# EAGLE design anambe_azul (EAGLE 7.7.0)
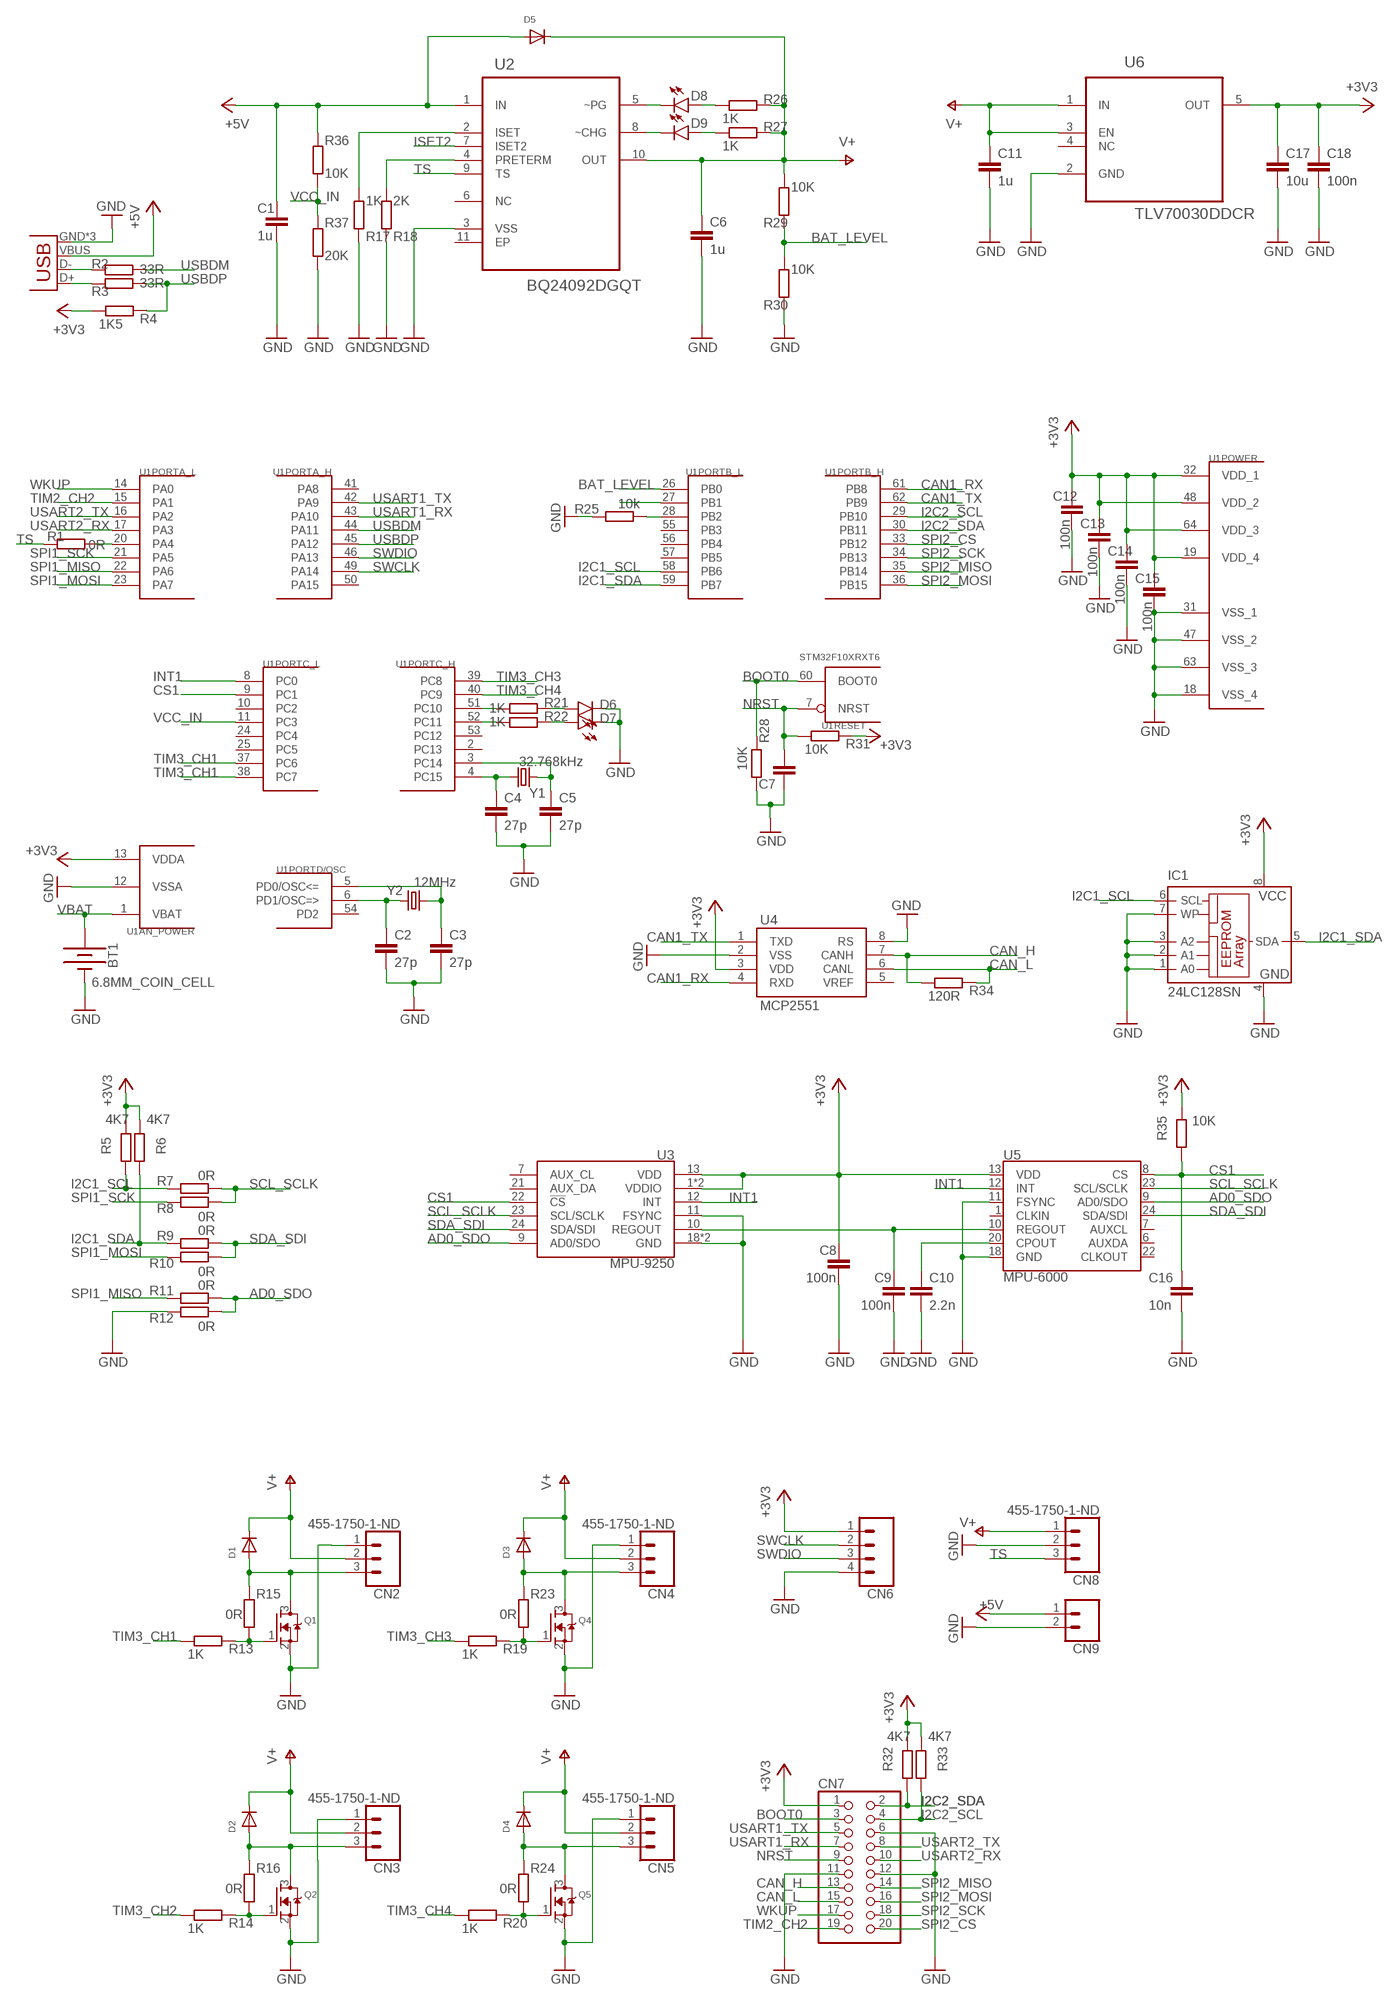
[diagram p0: schematic, sheet 1]

## Parts
BT1  6.8MM_COIN_CELL  BATTERY-6.8MM_SMD  [BATTCON-6.8MM]
C1  1u  C-EUC0603  [C0603]
C2  27p  C-EUC0603  [C0603]
C3  27p  C-EUC0603  [C0603]
C4  27p  C-EUC0603  [C0603]
C5  27p  C-EUC0603  [C0603]
C6  1u  C-EUC0603  [C0603]
C7  C-EUC0603  [C0603]
C8  100n  C-EUC0603  [C0603]
C9  100n  C-EUC0603  [C0603]
C10  2.2n  C-EUC0603  [C0603]
C11  1u  C-EUC0603  [C0603]
C12  100n  C-EUC0603  [C0603]
C13  100n  C-EUC0603  [C0603]
C14  100n  C-EUC0603  [C0603]
C15  100n  C-EUC0603  [C0603]
C16  10n  C-EUC0603  [C0603]
C17  10u  C-EUC0603  [C0603]
C18  100n  C-EUC0603  [C0603]
CN1  SPARKFUN-CONNECTORS_USB-MICROB  [SPARKFUN-CONNECTORS_USB-MICROB]
CN2  455-1750-1-ND  CONN_03  [1X03]
CN3  455-1750-1-ND  CONN_03  [1X03]
CN4  455-1750-1-ND  CONN_03  [1X03]
CN5  455-1750-1-ND  CONN_03  [1X03]
CN6  CONN_04  [1X04]
CN7  PINHD-2X10  [2X10]
CN8  455-1750-1-ND  CONN_03  [1X03]
CN9  CONN_02  [1X02]
D1  DIODESOD-123  [SOD-123]
D2  DIODESOD-123  [SOD-123]
D3  DIODESOD-123  [SOD-123]
D4  DIODESOD-123  [SOD-123]
D5  DIODESOD-123  [SOD-123]
D6  LED0603  [LED-0603]
D7  LED0603  [LED-0603]
D8  LED0603  [LED-0603]
D9  LED0603  [LED-0603]
IC1  24LC128SN  [SO-08]
Q1  MOSFET-NREFLOW  [SOT23]
Q2  MOSFET-NREFLOW  [SOT23]
Q4  MOSFET-NREFLOW  [SOT23]
Q5  MOSFET-NREFLOW  [SOT23]
R1  0R  R-EU_R0603  [R0603]
R2  33R  R-EU_R0603  [R0603]
R3  33R  R-EU_R0603  [R0603]
R4  1K5  R-EU_R0603  [R0603]
R5  4K7  R-EU_R0603  [R0603]
R6  4K7  R-EU_R0603  [R0603]
R7  0R  R-EU_R0603  [R0603]
R8  0R  R-EU_R0603  [R0603]
R9  0R  R-EU_R0603  [R0603]
R10  0R  R-EU_R0603  [R0603]
R11  0R  R-EU_R0603  [R0603]
R12  0R  R-EU_R0603  [R0603]
R13  1K  R-EU_R0603  [R0603]
R14  1K  R-EU_R0603  [R0603]
R15  0R  R-EU_R0603  [R0603]
R16  0R  R-EU_R0603  [R0603]
R17  1K  R-EU_R0603  [R0603]
R18  2K  R-EU_R0603  [R0603]
R19  1K  R-EU_R0603  [R0603]
R20  1K  R-EU_R0603  [R0603]
R21  1K  R-EU_R0603  [R0603]
R22  1K  R-EU_R0603  [R0603]
R23  0R  R-EU_R0603  [R0603]
R24  0R  R-EU_R0603  [R0603]
R25  10k  R-EU_R0603  [R0603]
R26  1K  R-EU_R0603  [R0603]
R27  1K  R-EU_R0603  [R0603]
R28  10K  R-EU_R0603  [R0603]
R29  10K  R-EU_R0603  [R0603]
R30  10K  R-EU_R0603  [R0603]
R31  10K  R-EU_R0603  [R0603]
R32  4K7  R-EU_R0603  [R0603]
R33  4K7  R-EU_R0603  [R0603]
R34  120R  R-EU_R0603  [R0603]
R35  10K  R-EU_R0603  [R0603]
R36  10K  R-EU_R0603  [R0603]
R37  20K  R-EU_R0603  [R0603]
U1  STM32F10XRXT6  [TQFP64]
U2  BQ24092DGQT  [SOP50P490X110-11N]
U3  MPU-9250  [QFN24-3X3]
U4  MCP2551  [SO08]
U5  MPU-6000  [QFN-24-EP]
U6  TLV70030DDCR  [SOT95P280X110-5N]
Y1  32.768kHz  CRYSTAL-32.768KHZPTH-2X6  [CRYSTAL-PTH-2X6-CYL]
Y2  12MHz  CRYSTALHC49UP  [HC49UP]

## Nets
+3V3: C8.1 C12.1 C13.1 C14.1 C15.1 C17.1 C18.1 CN6.1 CN7.1 IC1.8(VCC) R4.1 R5.1 R6.1 R31.2 R32.1 R33.1 R35.2 U1.13(AN_POWER:VDDA) U1.19(POWER:VDD_4) U1.32(POWER:VDD_1) U1.48(POWER:VDD_2) U1.64(POWER:VDD_3) U3.1(VDDIO) U3.8(VDDIO) U3.13(VDD) U4.3(VDD) U5.13(VDD) U6.5(OUT)
+5V: C1.1 CN1.VBUS CN9.1 D5.A R36.2 U2.1(IN)
AD0_SDO: R11.1 R12.1 U3.9(AD0/SDO) U5.9(AD0/SDO)
BAT_LEVEL: R29.2 R30.1 U1.26(PORTB_L:PB0)
BOOT0: CN7.3 R28.2 U1.60(RESET:BOOT0)
CAN1_RX: U1.61(PORTB_H:PB8) U4.4(RXD)
CAN1_TX: U1.62(PORTB_H:PB9) U4.1(TXD)
CAN_H: CN7.13 R34.1 U4.7(CANH)
CAN_L: CN7.15 R34.2 U4.6(CANL)
CS1: C16.1 R35.1 U1.9(PORTC_L:PC1) U3.22(!CS) U5.8(CS)
GND: BT1.- C1.2 C2.2 C3.2 C4.2 C5.2 C6.2 C7.1 C8.2 C9.2 C10.2 C11.2 C12.2 C13.2 C14.2 C15.2 C16.2 C17.2 C18.2 CN1.GND CN1.MT1(GND) CN1.MT2(GND) CN2.1 CN3.1 CN4.1 CN5.1 CN6.4 CN7.6 CN7.11 CN7.12 CN8.2 CN9.2 D6.C D7.C IC1.1(A0) IC1.2(A1) IC1.3(A2) IC1.4(GND) IC1.7(WP) Q1.2(S) Q2.2(S) Q4.2(S) Q5.2(S) R12.2 R17.2 R18.2 R25.2 R28.1 R30.2 R37.2 U1.12(AN_POWER:VSSA) U1.18(POWER:VSS_4) U1.31(POWER:VSS_1) U1.47(POWER:VSS_2) U1.63(POWER:VSS_3) U2.3(VSS) U3.11(FSYNC) U3.18(GND) U3.20(GND) U4.2(VSS) U4.8(RS) U5.11(FSYNC) U5.18(GND) U6.2(GND)
I2C1_SCL: IC1.6(SCL) R5.2 R7.2 U1.58(PORTB_L:PB6)
I2C1_SDA: IC1.5(SDA) R6.2 R9.2 U1.59(PORTB_L:PB7)
I2C2_SCL: CN7.4 R33.2 U1.29(PORTB_H:PB10)
I2C2_SDA: CN7.2 R32.2 U1.30(PORTB_H:PB11)
INT1: U1.8(PORTC_L:PC0) U3.12(INT) U5.12(INT)
ISET2: U1.27(PORTB_L:PB1) U2.7(ISET2)
N$1: C2.1 U1.6(PORTD/OSC:PD1/OSC=>) Y2.1
N$2: CN1.D+ R3.1
N$3: C3.1 U1.5(PORTD/OSC:PD0/OSC<=) Y2.2
N$4: Q1.1(G) R13.2 R15.1
N$5: CN1.D- R2.1
N$6: C4.1 U1.4(PORTC_H:PC15) Y1.2
N$7: C5.1 U1.3(PORTC_H:PC14) Y1.1
N$8: CN2.3 D1.A Q1.3(D) R15.2
N$9: Q4.1(G) R19.2 R23.1
N$10: CN4.3 D3.A Q4.3(D) R23.2
N$11: Q2.1(G) R14.2 R16.1
N$12: C10.1 U5.20(CPOUT)
N$13: C9.1 U3.10(REGOUT) U5.10(REGOUT)
N$14: D9.C U2.8(~CHG)
N$15: CN3.3 D2.A Q2.3(D) R16.2
N$16: Q5.1(G) R20.2 R24.1
N$17: CN5.3 D4.A Q5.3(D) R24.2
N$18: R25.1 U1.28(PORTB_L:PB2)
N$19: D9.A R27.1
N$21: D8.A R26.1
N$22: D8.C U2.5(~PG)
N$23: R17.1 U2.2(ISET)
N$24: R18.1 U2.4(PRETERM)
N$25: R21.1 U1.51(PORTC_H:PC10)
N$26: R22.1 U1.52(PORTC_H:PC11)
N$27: D6.A R21.2
N$28: D7.A R22.2
N$29: R1.1 U1.20(PORTA_L:PA4)
NRST: C7.2 CN7.9 R31.1 U1.7(RESET:NRST)
SCL_SCLK: R7.1 R8.1 U3.23(SCL/SCLK) U5.23(SCL/SCLK)
SDA_SDI: R9.1 R10.1 U3.24(SDA/SDI) U5.24(SDA/SDI)
SPI1_MISO: R11.2 U1.22(PORTA_L:PA6)
SPI1_MOSI: R10.2 U1.23(PORTA_L:PA7)
SPI1_SCK: R8.2 U1.21(PORTA_L:PA5)
SPI2_CS: CN7.20 U1.33(PORTB_H:PB12)
SPI2_MISO: CN7.14 U1.35(PORTB_H:PB14)
SPI2_MOSI: CN7.16 U1.36(PORTB_H:PB15)
SPI2_SCK: CN7.18 U1.34(PORTB_H:PB13)
SWCLK: CN6.2 U1.49(PORTA_H:PA14)
SWDIO: CN6.3 U1.46(PORTA_H:PA13)
TIM2_CH2: CN7.19 U1.15(PORTA_L:PA1)
TIM3_CH1: R13.1 U1.37(PORTC_L:PC6)
TIM3_CH2: R14.1 U1.38(PORTC_L:PC7)
TIM3_CH3: R19.1 U1.39(PORTC_H:PC8)
TIM3_CH4: R20.1 U1.40(PORTC_H:PC9)
TS: CN8.3 R1.2 U2.9(TS)
USART1_RX: CN7.7 U1.43(PORTA_H:PA10)
USART1_TX: CN7.5 U1.42(PORTA_H:PA9)
USART2_RX: CN7.10 U1.17(PORTA_L:PA3)
USART2_TX: CN7.8 U1.16(PORTA_L:PA2)
USBDM: R2.2 U1.44(PORTA_H:PA11)
USBDP: R3.2 R4.2 U1.45(PORTA_H:PA12)
V+: C6.1 C11.1 CN2.2 CN3.2 CN4.2 CN5.2 CN8.1 D1.C D2.C D3.C D4.C D5.C R26.2 R27.2 R29.1 U2.10(OUT) U6.1(IN) U6.3(EN)
VBAT: BT1.+ U1.1(AN_POWER:VBAT)
VCC_IN: R36.1 R37.1 U1.11(PORTC_L:PC3)
WKUP: CN7.17 U1.14(PORTA_L:PA0)
Unconnected: U1.2(PORTC_H:PC13) U1.10(PORTC_L:PC2) U1.24(PORTC_L:PC4) U1.25(PORTC_L:PC5) U1.41(PORTA_H:PA8) U1.50(PORTA_H:PA15) U1.53(PORTC_H:PC12) U1.54(PORTD/OSC:PD2) U1.55(PORTB_L:PB3) U1.56(PORTB_L:PB4) U1.57(PORTB_L:PB5) U2.6(NC) U2.11(EP) U3.7(AUX_CL) U3.21(AUX_DA) U4.5(VREF) U5.1(CLKIN) U5.6(AUXDA) U5.7(AUXCL) U5.22(CLKOUT) U6.4(NC)

## Library data of the parts
BT1 = SparkFun-Batteries:BATTERY: Battery - Single Cell A variety of battery chemistries, sizes, and footprints. Device List: 20MM_PTH - Coin Cell Battery Holder - 20mm (PTH) <https://www.sparkfun.com/products/783> 6.8MM_PTH - Coin Cell Battery Holder - 6.8MM(SMD) <https://www.digikey.com/product-detail/en/seiko-instruments/MS621FE-FL11E/728-1057-ND/1889208?WT.srch=1&gclid=CNOQ5a6LzdQCFZS2wAodXCkE0g> 12MM_SMD - Coin Cell Battery Holder - 12mm (SMD) <https://www.sparkfun.com/products/10592> 12MM_PTH - Coin Cell Battery Holder - 12mm (PTH) <https://www.sparkfun.com/products/7948> 20MM_SMD - 20mm Coin Cell Battery Holder (SMD) (2 legs) Used on the Big Time Watch Kit <https://www.sparkfun.com/products/11734> 20MM_SMD_4LEGS - Coin Cell Battery Holder - 20mm (SMD) <https://www.sparkfun.com/products/11892> 20MM_SMD_4LEGS_OVERPASTE - Coin Cell Battery Holder - 20mm (SMD) <https://www.sparkfun.com/products/11892> (Over-paste on the legs) 24.5MM_PTH - Coin Cell Battery Holder - 24.5mm (PTH) <https://www.sparkfun.com/products/8863> 9V - 9V Battery Holder - PC Mount Used on the SparkFun SparkPunk Sound Kit <https://www.sparkfun.com/products/11177> and SparkFun SparkPunk Sequencer Kit <https://www.sparkfun.com/products/12707> 18650 - Battery Holder - 18650 (PTH) <https://www.sparkfun.com/products/13113> AA - Battery Holder - 1xAA (PTH) <https://www.sparkfun.com/products/7949> AAA - Battery Holder - 1xAAA (PTH) <https://www.sparkfun.com/products/12718> AA_KIT - Battery Holder - 1xAA (PTH) <https://www.sparkfun.com/products/7949> Special kit package - pads only have exposed copper on one side of the board. AAA_KIT - Battery Holder - 1xAAA (PTH) <https://www.sparkfun.com/products/12718> Special kit package - pads only have exposed copper on one side of the board.; PROD_ID: BATT-13734
C1-C18 = rcl:C-EU: CAPACITOR, European symbol
CN1 = vr-f4:SPARKFUN-CONNECTORS_USB: USB Connectors USB-B-PTH is fully proven SKU : PRT-00139/CONN-08278 USB-miniB is fully proven SKU : PRT-00587 USB-A-PCB is untested. USB-A-H is throughly reviewed, but untested. Spark Fun Electronics SKU : PRT-00437 USB-B-SMT is throughly reviewed, but untested. Needs silkscreen touching up. USB-A-S has not been used/tested USB-MB-H has not been used/tested USB-MICROB has been used. CONN-09505; PROD_ID: CONN-09505
CN2-CN5 CN8 = SparkFun-Connectors:CONN_03: Multi connection point. Often used as Generic Header-pin footprint for 0.1 inch spaced/style header connections On any of the 0.1 inch spaced packages, you can populate with these: Break Away Headers - Straight <https://www.sparkfun.com/products/116> (PRT-00116) Break Away Male Headers - Right Angle <https://www.sparkfun.com/products/553> (PRT-00553) Female Headers <https://www.sparkfun.com/products/115> (PRT-00115) Break Away Headers - Machine Pin <https://www.sparkfun.com/products/117> (PRT-00117) Break Away Female Headers - Swiss Machine Pin <https://www.sparkfun.com/products/743> (PRT-00743) Stackable Header - 3 Pin (Female, 0.1") <https://www.sparkfun.com/products/13875> (PRT-13875) For SCREWTERMINALS and SPRING TERMINALS visit here: Screw Terimnals on SparkFun.com <https://www.sparkfun.com/search/results?term=Screw+Terminals> (5mm/3.5mm/2.54mm spacing) This device is also useful as a general connection point to wire up your design to another part of your project. Our various solder wires solder well into these plated through hole pads. Hook-Up Wire - Assortment (Stranded, 22 AWG) <https://www.sparkfun.com/products/11375> (PRT-11375) Hook-Up Wire - Assortment (Solid Core, 22 AWG) <https://www.sparkfun.com/products/11367> (PRT-11367) View the entire wire category on our website here <https://www.sparkfun.com/categories/141> Special notes: Molex polarized connector foot print use with SKU : PRT-08232 with associated crimp pins and housings.; PROD_ID: XXX-00000
CN6 = SparkFun-Connectors:CONN_04: Multi connection point. Often used as Generic Header-pin footprint for 0.1 inch spaced/style header connections On any of the 0.1 inch spaced packages, you can populate with these: Break Away Headers - Straight <https://www.sparkfun.com/products/116> (PRT-00116) Break Away Male Headers - Right Angle <https://www.sparkfun.com/products/553> (PRT-00553) Female Headers <https://www.sparkfun.com/products/115> (PRT-00115) Break Away Headers - Machine Pin <https://www.sparkfun.com/products/117> (PRT-00117) Break Away Female Headers - Swiss Machine Pin <https://www.sparkfun.com/products/743> (PRT-00743) For SCREWTERMINALS and SPRING TERMINALS visit here: Screw Terimnals on SparkFun.com <https://www.sparkfun.com/search/results?term=Screw+Terminals> (5mm/3.5mm/2.54mm spacing) This device is also useful as a general connection point to wire up your design to another part of your project. Our various solder wires solder well into these plated through hole pads. Hook-Up Wire - Assortment (Stranded, 22 AWG) <https://www.sparkfun.com/products/11375> (PRT-11375) Hook-Up Wire - Assortment (Solid Core, 22 AWG) <https://www.sparkfun.com/products/11367> (PRT-11367) View the entire wire category on our website here <https://www.sparkfun.com/categories/141> Special notes: Molex polarized connector foot print use with SKU : PRT-08231 with associated crimp pins and housings. 1MM SMD Version SKU: PRT-10208; PROD_ID: CONN-09696
CN7 = pinhead:PINHD-2X10: PIN HEADER
CN9 = SparkFun-Connectors:CONN_02: Multi connection point. Often used as Generic Header-pin footprint for 0.1 inch spaced/style header connections On any of the 0.1 inch spaced packages, you can populate with these: Break Away Headers - Straight <https://www.sparkfun.com/products/116> (PRT-00116) Break Away Male Headers - Right Angle <https://www.sparkfun.com/products/553> (PRT-00553) Female Headers <https://www.sparkfun.com/products/115> (PRT-00115) Break Away Headers - Machine Pin <https://www.sparkfun.com/products/117> (PRT-00117) Break Away Female Headers - Swiss Machine Pin <https://www.sparkfun.com/products/743> (PRT-00743) For SCREWTERMINALS and SPRING TERMINALS visit here: Screw Terimnals on SparkFun.com <https://www.sparkfun.com/search/results?term=Screw+Terminals> (5mm/3.5mm/2.54mm spacing) This device is also useful as a general connection point to wire up your design to another part of your project. Our various solder wires solder well into these plated through hole pads. Hook-Up Wire - Assortment (Stranded, 22 AWG) <https://www.sparkfun.com/products/11375> (PRT-11375) Hook-Up Wire - Assortment (Solid Core, 22 AWG) <https://www.sparkfun.com/products/11367> (PRT-11367) View the entire wire category on our website here <https://www.sparkfun.com/categories/141> Special notes: Molex polarized connector foot print use with: PRT-08233 with associated crimp pins and housings. 2.54_SCREWTERM for use with PRT-10571. 3.5mm Screw Terminal footprints for PRT-08084 5mm Screw Terminal footprints for use with PRT-08432
D1-D5 = adafruit:DIODE: Diode SMADIODE - SMA Surface Mount Package 20V 1A Schottky Diode Digikey: 641-1014-6-ND DO-1N4148 - Through Hole Small Current Diode SOD-123 20V 1 A (.5mV Vf) Schottky Diode - Digikey: MBRX120TPMSCT-ND SOD-323 10V 570mA (.38mV Vf, 3ns) Schottky Diode - Digikey: ZLLS410CT-ND SOD-523 30V 30mA Schottky Diode (RB751S-40TE61) - Digikey: RB751S-40TE61CT-ND SOT23-R/W - SOT23 Package (R = Solder Paste/Reflow Ovens, W = Hand-Soldering) BAT54Film 40V 300mA - Digikey: 497-7162-1-ND
D6-D9 = SparkFun-LED:LED: LED (Generic) Standard schematic elements and footprints for 5mm, 3mm, 1206, and 0603 sized LEDs. Generic LEDs with no color specified.
IC1 = microchip:24*: Serial EEPROM I2C; MF: MICROCHIP; MPN: 24LC128-I/SNG; OC_FARNELL: 9757937; OC_NEWARK: 30H1511
Q1 Q2 Q4 Q5 = adafruit:MOSFET-N: N-Channel Mosfet 2N7002E - 60V 260mA SOT23 [Digikey: 2N7002ET1GOSTR-ND] - REEL BSH103 - 30V 850mA SOT23 [Digikey: 568-5013-1-ND]
R1-R37 = rcl:R-EU_: RESISTOR, European symbol
U1 = stm32:STM32F10XRXT6: STM32F101/103 64pin LQFP
U2 = Texas Instruments_By_element14_Batch_1:BQ24092DGQT: 1A, Single-Input, Single Cell Li-Ion Battery Charger; MPN: BQ24092DGQT; OC_FARNELL: -; OC_NEWARK: 79R7875; PACKAGE: MSOP-10; SUPPLIER: Texas Instruments
U3 = SparkFun-Sensors:MPU-9250: MPU-9250 9 Degree of Freedom IMU System in Package that contains MPU-6500 & AK8963 NC pin 19. 2-6 & 14-17 not internally connected. May be used for PCB trace routing. Datasheet <https://cdn.sparkfun.com/assets/learn_tutorials/5/5/0/MPU9250REV1.0.pdf> SparkFun Products: SparkFun 9DoF Razor IMU M0 <https://www.sparkfun.com/products/14001> SparkFun IMU Breakout - MPU-9250 <https://www.sparkfun.com/products/13762>; PROD_ID: IC-13192; VALUE: 9DoF IMU
U4 = SparkFun-IC-Comms:MCP2551: MCP2551 High Speed CAN Transceiver High speed CAN transceiver Datasheet <http://www.sparkfun.com/datasheets/DevTools/Arduino/MCP2551.pdf> SparkFun Products CAN-BUS Shield <https://www.sparkfun.com/products/13262> (DEV-13262) SparkFun OBD-II UART <https://www.sparkfun.com/products/9555> (WIG-09555); PROD_ID: IC-09907
U5 = SparkFun-Sensors:MPU-6000: Invensense MPU-6000 6-Axis Gryoscope/Accelerometer 3-axis gyroscope, 3-axis accelerometer in a 4x4 package. The MPU-6000 is the world’s first 6-axis I²C MotionTracking device designed for the low power, low cost, and high performance requirements of smartphones, tablets and wearable sensors. Datasheet <http://cdn.sparkfun.com/datasheets/Components/General%20IC/PS-MPU-6000A.pdf> SparkFun Products MPU-6000 - Motion Processing Unit <https://www.sparkfun.com/products/11234> (SEN-11234) SparkFun UDB5 - PIC UAV Development Board <https://www.sparkfun.com/products/11703> (GPS-11703); PROD_ID: IC-11089; SF_ID: SEN-11234
U6 = Texas Instruments_By_element14_Batch_1:TLV70030DDCR: 200-mA, Low-IQ, Low-Dropout Regulator for Portable Devices; MPN: TLV70030DDCR; OC_FARNELL: -; OC_NEWARK: 55R7466; PACKAGE: TSOT-23-5; SUPPLIER: Texas Instruments
Y1 = SparkFun-Clocks:CRYSTAL-32.768KHZ: 32.768kHz Crystal Frequency: 32.768kHz Frequency Stability: ±20ppm Load Capacitance: 12.5pF (PTH-2X6 & SMD-3.2X1.5), 6pF (SMD-2X6) SparkFun Products: SparkFun BigTime Watch Kit <https://www.sparkfun.com/products/11734> SparkFun nRF52832 Breakout <https://www.sparkfun.com/products/13990> SparkFun Real Time Clock Module <https://www.sparkfun.com/products/12708>; PROD_ID: XTAL-10112
Y2 = crystal:CRYSTAL: CRYSTAL; OC_FARNELL: unknown; OC_NEWARK: unknown

## Net classes
0 signal: width 0.203 mm

## Board
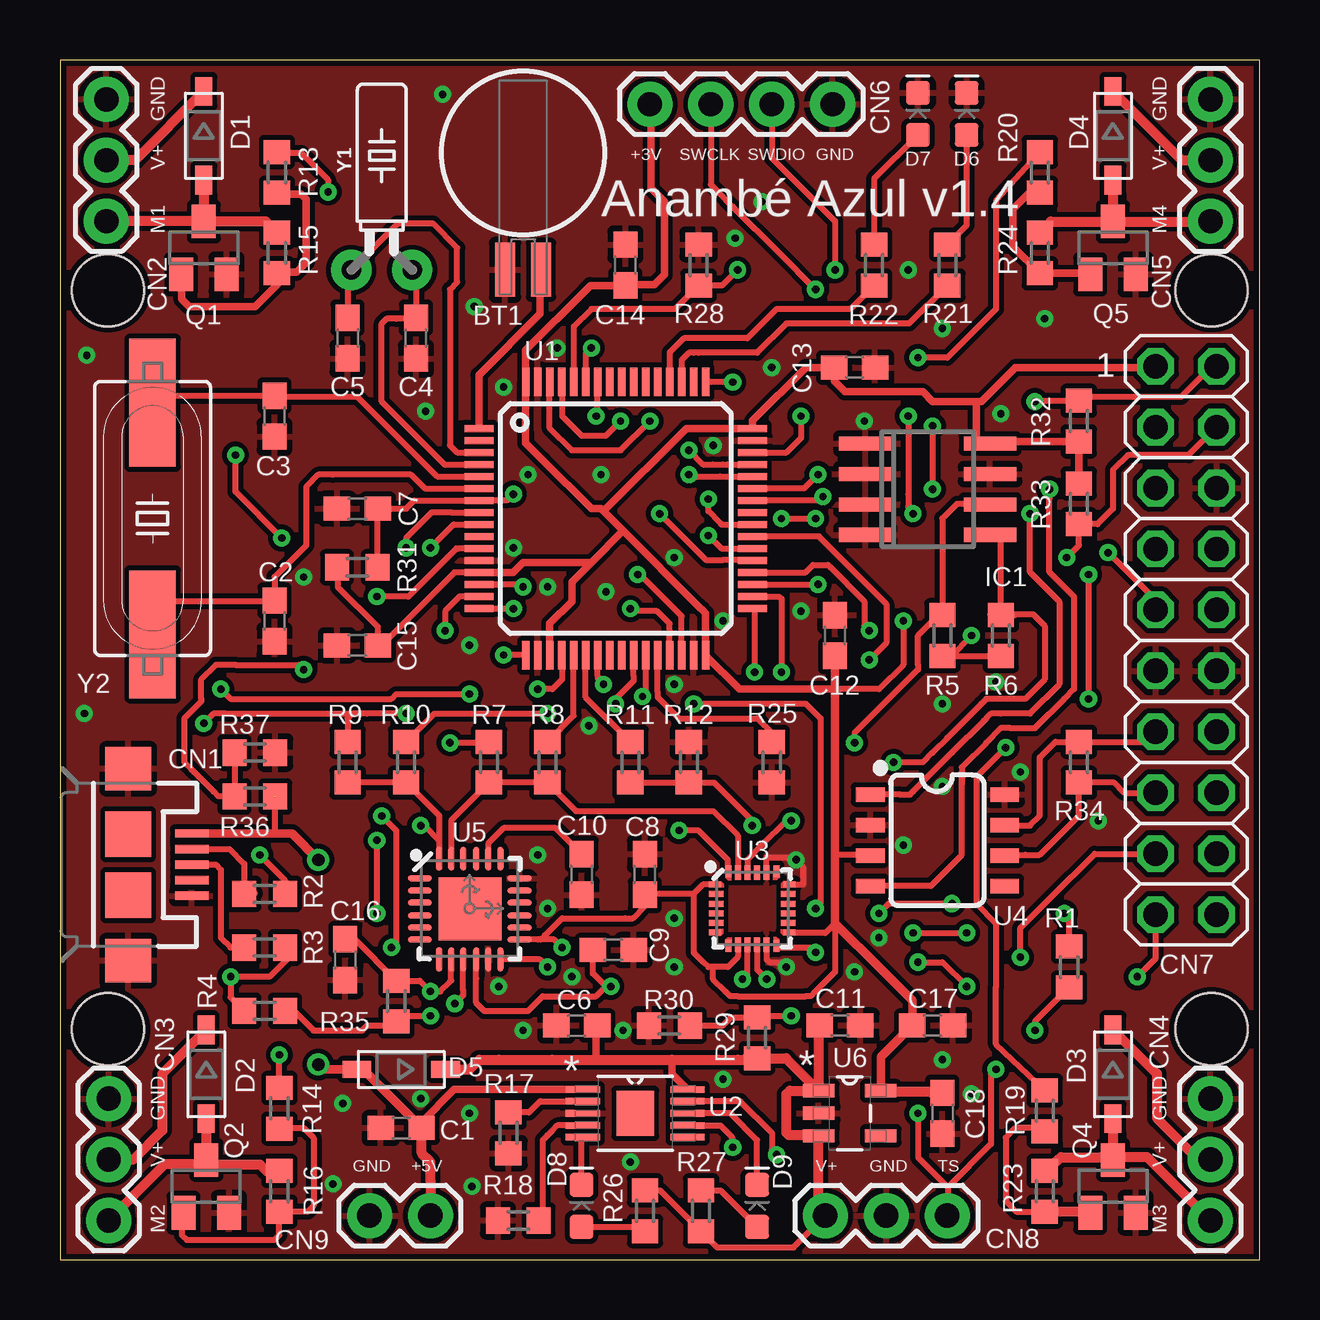
[diagram p1: board, top side]
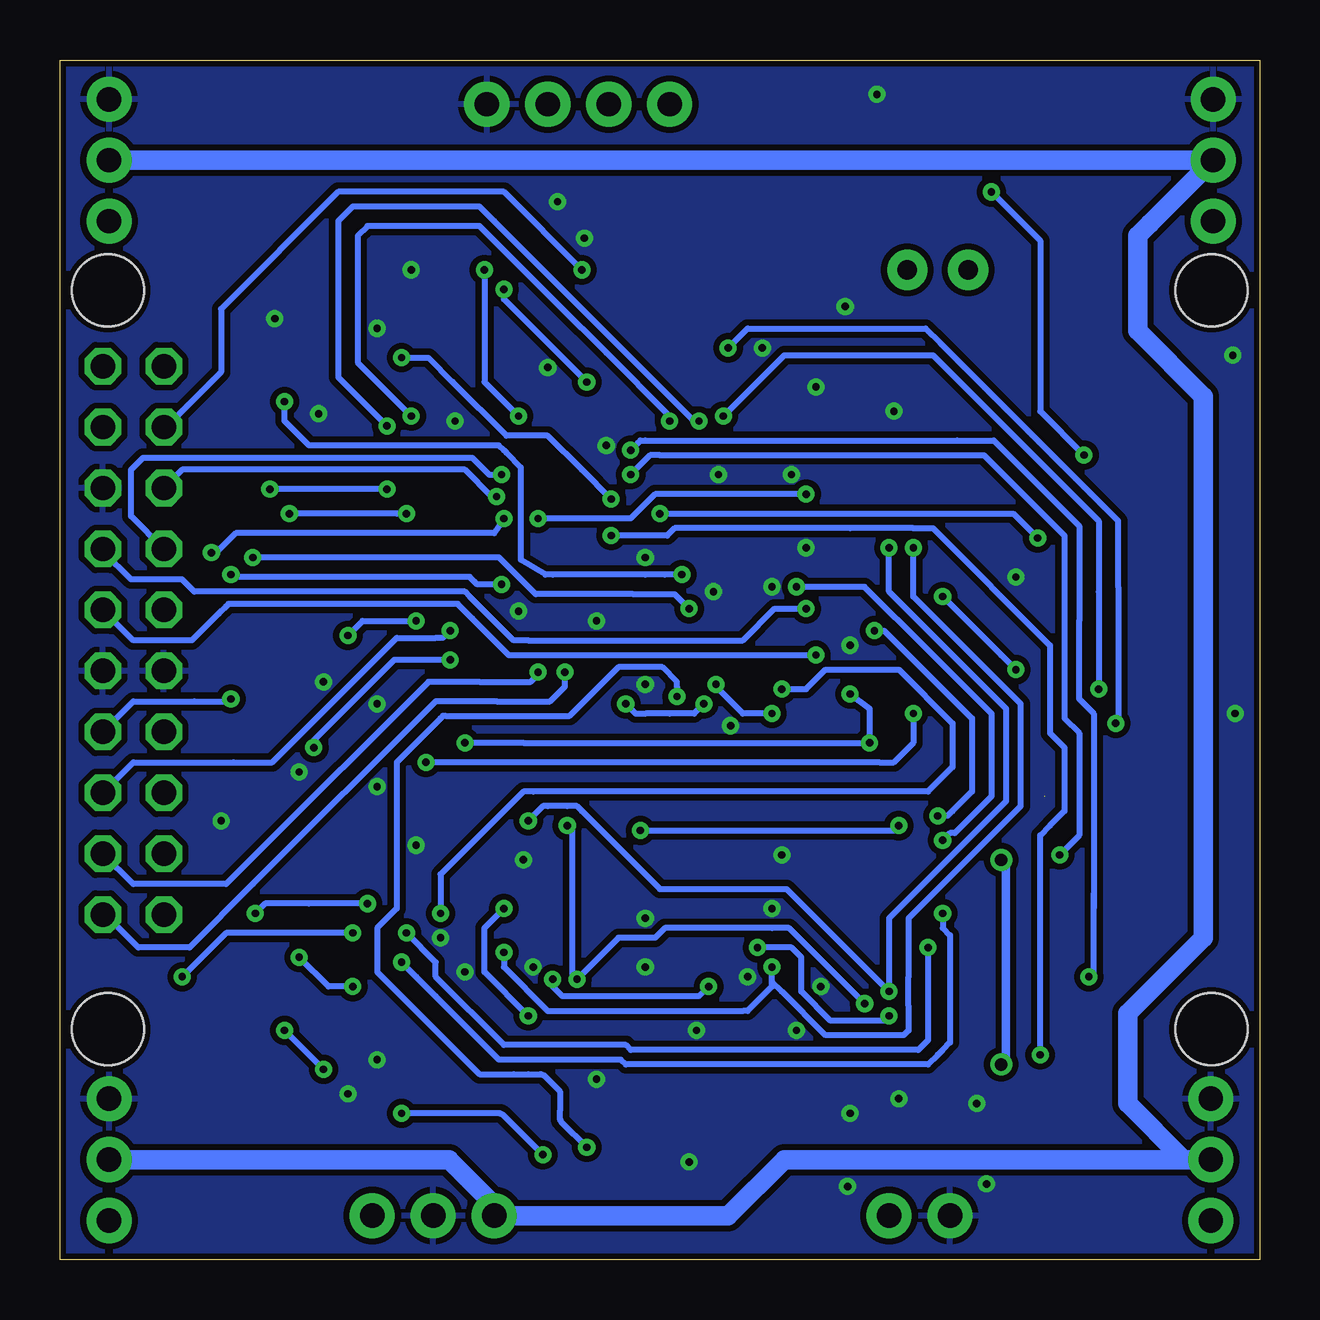
[diagram p2: board, bottom side, seen from below]

Size 50 x 50 mm. Coordinates in mm from the lower left corner, seen from the top.
Outline: 0,0 50,0 50,50 0,50 0,0
Copper layers (1*16): Top 0.035mm / dielectric 1.5mm / Bottom 0.035mm
Design rules "default *": minimum track width 10mil, minimum drill 12mil, track to track 8mil, track to pad 8mil, pad to pad 8mil, via to via 8mil, smd to smd 8mil, copper to edge 10mil, drill to drill 8mil, minimum pad ring 10mil, minimum via ring 8mil, stop-mask expansion 4mil, vias tented up to drill 0mil, thermal gap 10mil
Holes 3 mm at 2,40.4 48,40.4 48,9.6 2,9.6

### Footprints (pad centres in the part's own frame; a part is rotated, then mirrored left to right if it is on the bottom)
BATTCON-6.8MM = smd 2.25 x 0.85: + 4.87,0.75; - 4.87,-0.75
C0603 = smd 1.1 x 1: 1 -0.85,0; 2 0.85,0
SPARKFUN-CONNECTORS_USB-MICROB = smd 0.35 x 1.4: D+ 0,2.65; D- -0.65,2.65; GND 1.3,2.65; ID 0.65,2.65; VBUS -1.3,2.65 | smd 1.8 x 1.9: MT1 -4,0; MT2 4,0 | smd 1.9 x 1.9: P$1 -1.27,0; P$2 1.27,0
1X03 = drill 1.016 pad 1.88: 1 0,0; 2 2.54,0; 3 5.08,0
1X04 = drill 1.016 pad 1.88: 1 0,0; 2 2.54,0; 3 5.08,0; 4 7.62,0
2X10 = drill 1.016 octagon: 1 -11.43,-1.27; 2 -11.43,1.27; 3 -8.89,-1.27; 4 -8.89,1.27; 5 -6.35,-1.27; 6 -6.35,1.27; 7 -3.81,-1.27; 8 -3.81,1.27; 9 -1.27,-1.27; 10 -1.27,1.27; 11 1.27,-1.27; 12 1.27,1.27; 13 3.81,-1.27; 14 3.81,1.27; 15 6.35,-1.27; 16 6.35,1.27; 17 8.89,-1.27; 18 8.89,1.27; 19 11.43,-1.27; 20 11.43,1.27
1X02 = drill 1.016 pad 1.88: 1 0,0; 2 2.54,0
SOD-123 = smd 1.2 x 0.7: A 1.85,0; C -1.85,0
LED-0603 = smd 1 x 1: A -0.877,0; C 0.877,0
SO-08 = smd 0.6 x 2.2: 1 -1.905,-2.6; 2 -0.635,-2.6; 3 0.635,-2.6; 4 1.905,-2.6; 5 1.905,2.6; 6 0.635,2.6; 7 -0.635,2.6; 8 -1.905,2.6
SOT23 = smd 1 x 1.4: 1 -0.95,-1.1; 2 0.95,-1.1; 3 0,1.1
R0603 = smd 1 x 1.1: 1 -0.85,0; 2 0.85,0
TQFP64 = smd 1.2 x 0.3: 1 -5.7,3.75; 2 -5.7,3.25; 3 -5.7,2.75; 4 -5.7,2.25; 5 -5.7,1.75; 6 -5.7,1.25; 7 -5.7,0.75; 8 -5.7,0.25; 9 -5.7,-0.25; 10 -5.7,-0.75; 11 -5.7,-1.25; 12 -5.7,-1.75; 13 -5.7,-2.25; 14 -5.7,-2.75; 15 -5.7,-3.25; 16 -5.7,-3.75; 33 5.7,-3.75; 34 5.7,-3.25; 35 5.7,-2.75; 36 5.7,-2.25; 37 5.7,-1.75; 38 5.7,-1.25; 39 5.7,-0.75; 40 5.7,-0.25; 41 5.7,0.25; 42 5.7,0.75; 43 5.7,1.25; 44 5.7,1.75; 45 5.7,2.25; 46 5.7,2.75; 47 5.7,3.25; 48 5.7,3.75 | smd 0.3 x 1.2: 17 -3.75,-5.7; 18 -3.25,-5.7; 19 -2.75,-5.7; 20 -2.25,-5.7; 21 -1.75,-5.7; 22 -1.25,-5.7; 23 -0.75,-5.7; 24 -0.25,-5.7; 25 0.25,-5.7; 26 0.75,-5.7; 27 1.25,-5.7; 28 1.75,-5.7; 29 2.25,-5.7; 30 2.75,-5.7; 31 3.25,-5.7; 32 3.75,-5.7; 49 3.75,5.7; 50 3.25,5.7; 51 2.75,5.7; 52 2.25,5.7; 53 1.75,5.7; 54 1.25,5.7; 55 0.75,5.7; 56 0.25,5.7; 57 -0.25,5.7; 58 -0.75,5.7; 59 -1.25,5.7; 60 -1.75,5.7; 61 -2.25,5.7; 62 -2.75,5.7; 63 -3.25,5.7; 64 -3.75,5.7
SOP50P490X110-11N = smd 1.422 x 0.279: 1 -2.184,0.991; 2 -2.184,0.508; 3 -2.184,0; 4 -2.184,-0.508; 5 -2.184,-0.991; 6 2.184,-0.991; 7 2.184,-0.508; 8 2.184,0; 9 2.184,0.508; 10 2.184,0.991 | smd 1.575 x 1.88: 11 0,0
QFN24-3X3 = smd 0.495 x 0.25: 1 -1.552,1; 6 -1.552,-1; 13 1.552,-1; 18 1.552,1 | smd 0.6 x 0.25: 2 -1.5,0.6; 3 -1.5,0.2; 4 -1.5,-0.2; 5 -1.5,-0.6; 14 1.5,-0.6; 15 1.5,-0.2; 16 1.5,0.2; 17 1.5,0.6 | smd 0.25 x 0.495: 7 -1,-1.552; 12 1,-1.552; 19 1,1.552; 24 -1,1.552 | smd 0.25 x 0.6: 8 -0.6,-1.5; 9 -0.2,-1.5; 10 0.2,-1.5; 11 0.6,-1.5; 20 0.6,1.5; 21 0.2,1.5; 22 -0.2,1.5; 23 -0.6,1.5
SO08 = smd 0.6 x 1.2: 1 -1.905,-2.8; 2 -0.635,-2.8; 3 0.635,-2.8; 4 1.905,-2.8; 5 1.905,2.8; 6 0.635,2.8; 7 -0.635,2.8; 8 -1.905,2.8
QFN-24-EP = smd 1.016 x 0.254: 1 -2.066,1.257; 2 -2.066,0.75; 3 -2.066,0.247; 4 -2.066,-0.287; 5 -2.066,-0.792; 6 -2.066,-1.297; 13 2.086,-1.297; 14 2.086,-0.792; 15 2.086,-0.287; 16 2.086,0.247; 17 2.086,0.75; 18 2.086,1.257 | smd 0.254 x 1.016: 7 -1.267,-2.122; 8 -0.762,-2.122; 9 -0.258,-2.122; 10 0.278,-2.122; 11 0.78,-2.122; 12 1.287,-2.122; 19 1.287,2.082; 20 0.78,2.082; 21 0.278,2.082; 22 -0.258,2.082; 23 -0.762,2.082; 24 -1.267,2.082 | smd 2.616 x 2.616: P$1 0.02,-0.01
SOT95P280X110-5N = smd 1.321 x 0.559: 1 -1.295,0.94; 2 -1.295,0; 3 -1.295,-0.94; 4 1.295,-0.94; 5 1.295,0.94
CRYSTAL-PTH-2X6-CYL = drill 0.813 pad 1.676: 1 -1.27,0; 2 1.27,0
HC49UP = smd 5.334 x 1.93: 1 -4.826,0; 2 4.826,0

### Placement (x,y rotation side)
BT1  19.3,46.13 270 top
C1  14.22,5.49 180 top
C2  8.94,26.62 270 top
C3  8.94,35.15 270 top
C4  14.83,38.4 270 top
C5  11.99,38.4 270 top
C6  21.54,9.75 180 top
C7  12.4,31.29 0 top
C8  24.38,16.05 90 top
C9  23.06,12.9 0 top
C10  21.74,16.05 270 top
C11  32.51,9.75 0 top
C12  32.31,26.01 90 top
C13  33.12,37.19 0 top
C14  23.57,41.45 90 top
C15  12.4,25.6 180 top
C16  11.89,12.5 270 top
C17  36.37,9.75 0 top
C18  36.78,6.1 270 top
CN1  2.84,16.46 270 top
CN2  1.93,48.36 270 top
CN3  2.03,6.71 270 top
CN4  47.96,6.71 270 top
CN5  47.96,48.36 270 top
CN6  24.59,48.16 0 top
CN7  46.94,25.81 270 top
CN8  31.9,1.83 0 top
CN9  15.44,1.83 180 top
D1  5.99,46.84 270 top
D2  6.1,7.72 270 top
D3  43.89,7.72 270 top
D4  43.89,46.84 270 top
D5  14.22,7.92 180 top
D6  37.8,47.75 90 top
D7  35.76,47.75 90 top
D8  21.74,2.24 90 top
D9  29.06,2.24 90 top
IC1  36.17,32.11 270 top
Q1  5.99,42.16 0 top
Q2  6.1,3.05 0 top
Q4  43.89,3.05 0 top
Q5  43.89,42.16 0 top
R1  42.06,12.19 270 top
R2  8.53,15.24 0 top
R3  8.53,13 0 top
R4  8.53,10.36 180 top
R5  36.78,26.01 90 top
R6  39.22,26.01 90 top
R7  17.88,20.73 90 top
R8  20.32,20.73 90 top
R9  11.99,20.73 90 top
R10  14.43,20.73 90 top
R11  23.77,20.73 90 top
R12  26.21,20.73 90 top
R13  9.04,45.31 270 top
R14  9.14,6.3 270 top
R15  9.04,41.96 90 top
R16  9.14,2.84 90 top
R17  18.69,5.28 270 top
R18  19.1,1.63 180 top
R19  41.05,6.2 270 top
R20  40.84,45.31 270 top
R21  36.98,41.45 90 top
R22  33.93,41.45 90 top
R23  41.05,2.84 90 top
R24  40.84,41.96 90 top
R25  29.67,20.73 270 top
R26  24.38,2.03 90 top
R27  26.72,2.03 270 top
R28  26.62,41.45 270 top
R29  29.06,9.25 90 top
R30  25.4,9.75 180 top
R31  12.4,28.85 180 top
R32  42.47,34.95 90 top
R33  42.47,31.5 270 top
R34  42.47,20.73 270 top
R35  14.02,10.77 270 top
R36  8.13,19.3 0 top
R37  8.13,21.13 0 top
U1  23.16,30.89 0 top
U2  23.98,6.1 0 top
U3  28.85,14.63 0 top
U4  36.58,17.48 270 top
U5  17.07,14.63 0 top
U6  32.92,6.1 0 top
Y1  13.41,41.25 0 top
Y2  3.86,30.89 90 top

### Tracks (layer width: path | path; a pad name or v marks a point on that pad's centre or on a via)
+3V3  (via drill 0.3)
  Top 0.254: C12.1 32.31,25.2 | 28.25,13.21 U3.8 28.25,12.61 27.84,12.19 27.23,12.19 | U3.13 31.92,13.63 | 31.92,13.63 32.31,14.02 32.31,11.99 31.5,11.18 31.29,10.97 31.09,10.97 28.25,10.97 27.94,10.97 27.74,11.18 27.23,11.68 27.23,12.19 | 31.9,13.61 31.92,13.63 | U3.1 26.81,15.63 26.42,15.24 | 26.42,15.24 26.42,12.8 26.82,12.39 27.03,12.19 27.23,12.19 | 26.42,15.24 24.42,15.24 C8.1 24.38,14.73 23.88,14.22 23.57,14.22 20.93,14.22 20.22,13.51 20.04,13.33 19.91,13.33 | 19.91,13.33 U5.13 | C14.1 23.41,40.44 | R31.2 11.58,28.82 11.58,28.04 13.24,26.38 C15.1 13.24,25.97 | U4.3 33.75,16.87 32.31,16.87 | R6.1 R5.1 37.15,25.16 v38,26.01 | v35.15,26.62 35.15,24.79 34.14,23.77 32.51,23.77 32.31,23.57 | v15.44,10.16 13.86,10.16 R35.2 13.86,9.75 12.8,9.75 12.6,9.55 10.57,9.55 9.75,10.36 R4.1 | v20.93,13.01 20.6,13.33 19.91,13.33 | U1.13 16.44,28.64 15.14,27.33 13.72,25.91 13.55,25.91
  Top 0.305: U1.32 26.92,25.2 | C13.1 31.09,37.19 28.86,34.96 U1.48 26.92,34.65 26.72,34.65 26.11,34.65 22.66,31.19 | C13.1 32.31,37.15 | R33.1 R32.1 38.25,34.1 IC1.8 38.16,34.18 arc45 38.2,34.28 38.2,35.76 | CN7.1 45.62,37.19 39.83,37.19 38.41,35.76 38.2,35.76 | 38.2,35.76 36.78,35.76 36.48,35.76 36.37,35.76 35.97,36.17 32.72,36.17 32.27,36.61 C13.1 | U1.32 28.33,23.77 32.31,23.77 | 23.47,30.38 26.62,27.23 26.82,27.03 26.91,26.93 U1.32 | 23.47,30.38 22.66,31.19 | 22.15,29.06 23.47,30.38 | U1.13 18.88,28.64 19.3,29.06 22.15,29.06 | 22.15,29.06 21.34,28.25 21.34,27.43 20.41,26.51 U1.19 | 22.66,31.19 22.55,31.29 22.15,31.29 20.12,33.33 19.51,33.93 19.41,34.03 19.41,34.43 U1.64 19.41,37.91 21.95,40.44 22.11,40.6 C14.1 23.61,40.64 24.79,40.64 25.2,41.05 25.2,44.09 24.64,44.65 24.64,47.9 CN6.1 | 13.55,25.91 C15.1
  Top 0.356: C12.1 32.31,24.99 | U6.5 34.21,8.45 C17.1 35.52,10.81 34.24,12.09 32.31,14.02 32.31,16.87 32.31,23.57 32.31,23.77 C12.1 | C12.1 32.28,25.19
  Top 0.406: U6.5 34.24,7.01 36.07,7.01 36.27,7.01 36.34,6.95 C18.1
  Bottom 0.254: v38,26.01 37.39,26.62 v35.15,26.62 | v15.44,10.16 15.65,9.96 17.27,9.96 17.68,9.96 17.88,9.96 19.1,11.18 19.1,12.19 19.1,12.6 19.51,13.01 v20.93,13.01
+5V  (via drill 0.51)  (1 unrouted)
  Top 0.254: 8.94,19.3 8.94,17.76
  Top 0.305: 20.55,7.09 21.13,7.09 | 21.13,7.09 U2.1 | C1.1 15.07,5.73 16.43,7.09 21.13,7.09
  Top 0.356: CN1.VBUS 7.92,17.76 8.94,17.76 9.37,17.76 9.47,17.76 9.67,17.76 v10.77,16.66 | 15.02,5.69 C1.1 12.64,7.92 D5.A 10.97,7.92 v10.77,8.13
  Top 0.406: C1.1 15.07,4.43 15.44,4.06 15.44,3.3 CN9.1
  Bottom 0.356: v10.77,8.13 10.57,8.33 10.57,8.53 10.57,10.97 10.57,15.44 10.57,15.85 10.57,16.46 v10.77,16.66
AD0_SDO  (via drill 0.3)
  Top 0.254: R11.1 R12.1 27.27,19.88 28.85,18.29 v28.85,18.09 | U5.9 16.81,11.22 16.81,11.02 v16.46,10.67 | U3.9 28.65,11.89 v28.45,11.68
  Bottom 0.254: v28.85,18.09 28.65,17.88 28.65,17.27 28.65,12.39 28.65,11.89 v28.45,11.68 26.72,13.41 26.63,13.41 25.2,13.41 24.79,13.82 20.32,13.82 19.61,13.82 19.13,13.34 v16.46,10.67
BAT_LEVEL  (via drill 0.3)
  Top 0.254: R30.1 27.64,9.75 27.98,10.1 R29.2 29.12,10.16 v30.48,10.16 | U1.26 23.91,24.32 23.91,24.12 23.16,23.37 v23.16,23.16 | v26.42,23.16 31.09,23.16 31.5,22.76 31.7,22.55 31.7,15.04 31.7,14.83 v31.5,14.63
  Bottom 0.254: v30.48,10.16 32.31,11.99 32.31,13.61 32.31,13.82 v31.5,14.63 | v23.16,23.16 23.37,22.96 23.57,22.76 24.59,22.76 25.6,22.76 26.01,22.76 v26.42,23.16
BOOT0  (via drill 0.3)
  Top 0.254: U1.60 21.41,38.89 22.15,39.62 25.64,39.62 R28.2 27.6,40.6 v28.25,41.25
  Bottom 0.254: v28.25,41.25 31.5,44.5 38.41,44.5 43.28,39.62 43.28,36.98 45.57,34.7 CN7.3
CAN1_RX  (via drill 0.3)
  Top 0.254: U1.61 20.93,36.57 20.93,35.15 21.74,34.34 22.76,34.34 v23.37,34.95 | v36.37,34.75 v36.37,32.11 | 41.25,31.7 v41.25,32.11 41.25,28.65 42.27,27.64 42.27,23.77 41.86,23.37 40.64,22.15 39.62,22.15 39.22,22.15 38.61,21.54 37.59,20.52 37.59,19.81 | U4.4 36.3,15.57 37.39,16.66 37.59,16.87 37.59,18.09 37.59,19.51 37.59,19.81 | 37.59,19.81 37.59,20.32
  Bottom 0.254: v36.37,34.75 36.58,34.95 38.41,36.78 38.41,43.28 37.8,43.89 36.37,43.89 32.51,43.89 31.9,43.28 23.57,34.95 v23.37,34.95 | v36.37,32.11 v41.25,32.11
CAN1_TX  (via drill 0.3)
  Top 0.254: U1.62 20.41,34.65 21.34,33.73 23.37,33.73 v24.59,34.95 | v35.36,35.15 35.36,31.9 35.36,31.4 arc45 35.43,31.22 v35.56,31.09 | U4.1 35.03,19.38 35.23,19.38 35.43,19.38 35.56,19.51 37.19,21.13 38.51,22.45 | v40.44,31.09 40.44,28.65 41.05,28.04 41.66,27.43 41.66,23.98 40.44,22.76 39.22,22.76 38.81,22.76 38.51,22.45 | 38.51,22.45 38.61,22.55
  Bottom 0.254: v35.36,35.15 37.59,37.39 37.59,42.67 37.19,43.08 32.51,43.08 29.26,39.83 27.23,37.8 24.59,35.15 v24.59,34.95 | v40.44,31.09 35.97,31.09 v35.56,31.09
CAN_H
  Top 0.254: U4.7 39.4,18.09 40.44,18.09 40.84,18.49 40.84,20.32 40.84,20.93 41.49,21.58 R34.1 45.25,21.58 CN7.13
CAN_L
  Top 0.254: U4.6 39.4,16.87 40.23,16.87 40.84,16.87 42.47,18.49 R34.2 | R34.2 42.51,20.12 | CN7.15 44.35,19.46 43.93,19.88 R34.2
CS1  (via drill 0.3)
  Top 0.254: 16.31,12.04 U5.8 16.31,11.63 16.26,11.58 15.85,11.18 v15.44,11.18 15,11.62 R35.1 12.29,13.35 C16.1 | U1.9 16.41,30.64 v15.44,29.67 | v30.48,18.29 30.28,18.29 29.26,17.27 28.65,16.67 U3.22
  Bottom 0.254: v30.48,18.29 29.87,18.9 29.67,18.9 28.85,18.9 28.45,18.9 28.25,18.69 24.99,15.44 19.71,15.44 v15.44,11.18 15.44,14.22 10.57,19.1 10.57,22.96 15.44,27.84 v15.44,29.67
GND  (via drill 0.3)
  Top 0.254: U3.11 29.45,12.51 29.57,12.39 30.07,12.39 v30.28,12.19 | U3.18 30.97,15.63 30.99,15.65 30.99,16.36 v30.68,16.66 30.58,16.76 29.46,16.76 29.45,16.75 U3.20
  other vias: 35.15,17.27 17.27,39.73 1.02,22.76 41.05,39.22 19.91,16.87 35.36,41.25 19.3,9.55 25.6,12.19 25.6,14.22 34.14,13.41 36.78,19.71 40.03,20.32 20.32,28.04 22.76,27.84 25.6,29.26 19.51,32.72 22.56,32.72 20.73,38 15.24,35.36 18.9,29.67 18.49,36.37 11.38,3.15 17.17,3.05 18.29,11.38 21.34,11.79 20.32,14.63 23.47,9.55 25.6,23.98 33.12,11.99 36.78,8.33 38,6.91 17.07,6.1 11.79,6.5 33.53,34.95 28.14,42.57 30.89,27.03 27.64,26.62 15.04,6.71 29.67,37.19 27.23,33.93 36.78,38.81 17.07,25.6 10.16,28.45 22.05,22.25 1.12,37.69 15.95,48.56 39.01,24.08 36.78,23.16 43.28,18.29 23.77,4.06 29.26,44.09 39.22,35.26 27.64,7.52
  pour Top: 0,49.99 0,0 49.99,0 49.99,49.99
  pour Bottom (isolate 0.254): 0,49.99 0,0 49.99,0 49.99,49.99
I2C1_SCL  (via drill 0.3)
  Top 0.254: R7.2 17.84,21.54 v16.26,21.54 | v22.35,35.15 22.41,35.22 U1.58 | IC1.6 38.74,31.5 37.39,31.5 36.78,30.89 R5.2 36.61,26.86 35.76,26.01 35.76,24.79 35.76,24.59 33.12,21.95 v33.12,21.54 | v6.71,23.77 6.91,23.57 7.11,23.37 13.82,23.37 14.02,23.57 v17.07,23.57
  Bottom 0.254: v33.12,21.54 30.68,21.54 v16.26,21.54 16.26,22.96 v17.07,23.57 | v6.71,23.77 6.71,27.84 6.71,30.79 13.61,37.69 15.95,37.69 19.81,37.69 v22.35,35.15
I2C1_SDA  (via drill 0.3)
  Top 0.254: IC1.5 38.08,30.28 | 11.95,21.54 R9.2 11.99,22.55 12.19,22.76 12.39,22.76 | v14.43,22.76 12.8,22.76 12.39,22.76 | 38.77,26.9 R6.2 39.79,26.86 | 21.95,36.62 U1.59 21.91,37.76 v22.15,38 | 12.39,22.76 6.91,22.76 6.4,22.76 v5.99,22.35 | IC1.5 38.81,30.16 | 38.77,26.9 39.22,27.35 39.22,30.28 39.14,30.2 IC1.5 | 38.77,26.9 40.56,26.9 41.05,26.42 41.05,24.18 40.23,23.37 38.61,23.37 38.41,23.16 36.98,21.74 36.37,21.13 35.97,20.73 v34.75,20.73
  Bottom 0.254: v14.43,22.76 14.43,21.54 15.24,20.73 15.85,20.73 24.99,20.73 32.92,20.73 v34.75,20.73 | v22.15,38 21.34,38.81 13.92,38.81 13.31,38.2 5.89,30.79 5.89,29.67 5.89,28.04 5.89,22.45 v5.99,22.35
I2C2_SCL  (via drill 0.3)
  Top 0.254: CN7.4 47.04,33.53 44.91,33.53 44.5,33.53 43.89,32.92 43.89,31.29 43.24,30.65 R33.2 42.47,29.77 v41.96,29.26 | 25.4,25.17 U1.29 25.41,26.2 25.41,26.5 24.89,27.03 23.88,27.03 v23.77,27.13
  Bottom 0.254: v41.96,29.26 31.7,29.26 31.39,28.96 30.18,27.74 26.11,27.74 24.38,27.74 v23.77,27.13
I2C2_SDA  (via drill 0.3)
  Top 0.254: CN7.2 48.01,37.24 46.74,35.97 42.63,35.97 R32.2 40.68,35.8 v40.64,35.76 | U1.30 25.91,26.82 24.18,28.55 v24.08,28.55
  Bottom 0.254: v40.64,35.76 40.64,34.95 39.62,33.93 31.9,33.93 31.7,33.93 31.5,33.73 31.39,33.63 30.79,33.02 30.79,32.31 30.79,29.16 29.77,28.55 29.46,28.55 25.6,28.55 24.79,28.55 v24.08,28.55
INT1  (via drill 0.3)
  Top 0.254: U3.12 29.93,13.01 31.09,13.01 31.29,13.01 v31.5,12.8 | U1.8 16.3,31.14 15.49,31.14 14.43,30.07 v14.43,29.67 | v20.32,12.19 20,12.51 U5.12
  Bottom 0.254: v31.5,12.8 31.5,12.19 29.67,10.36 21.54,10.36 21.34,10.36 20.32,11.38 20.32,11.58 | 15.44,9.35 16.05,9.35 | 16.05,9.35 16.66,9.35 17.48,9.35 17.88,9.35 18.09,9.35 19.91,11.18 20.32,11.58 | 16.05,9.35 14.83,9.35 14.63,9.55 14.63,10.16 14.63,10.57 14.63,11.79 14.63,14.22 9.96,18.9 9.96,19.91 9.96,23.16 14.02,27.23 14.43,27.64 v14.43,29.67 | 20.32,11.58 v20.32,12.19
ISET2  (via drill 0.3)
  Top 0.254: U2.7 27.53,5.59 27.97,5.15 arc-45 28.04,4.97 v28.04,4.67 | U1.27 24.41,23.6 v24.28,23.47
  Bottom 0.254: 31.09,7.72 30.48,7.72 | 30.48,7.72 32.51,7.72 34.54,9.75 36.78,11.99 36.78,13.82 35.97,14.63 35.97,16.66 35.97,20.73 34.14,22.55 34.04,22.66 33.93,22.66 28.75,22.66 27.94,23.47 26.72,24.69 24.89,24.69 24.28,24.08 24.28,23.88 v24.28,23.47 | 30.48,7.72 29.98,7.72 arc45 29.8,7.65 29.16,7.01 29.16,6.2 29.16,5.9 arc-45 29.09,5.72 v28.04,4.67
N$1
  Top 0.254: U1.6 15.21,32.14 14.63,32.72 11.38,32.72 10.77,32.72 10.26,32.21 10.26,29.97 10.26,29.77 8.94,28.45 C2.1 8.9,27.43 4.27,27.43 Y2.1
N$2
  Top 0.254: CN1.D+ 6.5,16.46 6.71,16.26 6.71,15.85 6.71,13.41 7.11,13.01 R3.1
N$3
  Top 0.254: Y2.2 4.56,36 C3.1 8.98,35.97 12.39,35.97 15.72,32.64 U1.5
N$4
  Top 0.305: R13.2 9.31,44.4 10.06,44.4 10.26,44.2 10.26,43.08 10.26,41.86 10.26,41.55 9.86,41.15 9.28,41.15 R15.1 9.04,40.64 8.13,39.73 5.38,39.73 5.28,39.83 5.08,40.03 5.08,41.03 Q1.1
N$5
  Top 0.254: CN1.D- 7.07,17.11 7.68,16.5 R2.1 8.13,15.28
N$6
  Top 0.254: C4.1 14.63,39.42 | Y1.2 14.83,41.1 C4.1 | C4.1 14.8,39.22 14.02,39.22 13.61,39.22 13.41,39.01 13.41,35.76 16.05,33.12 17.45,33.12 U1.4
N$7
  Top 0.254: 12.19,39.42 C5.1 11.99,41.1 Y1.1 13.56,42.67 14.07,43.18 15.54,43.18 16.56,42.16 16.56,40.74 16.26,40.44 16.26,33.93 16.55,33.64 U1.3
N$8
  Top 0.406: Q1.3 6.38,43.28 CN2.3 | D1.A Q1.3 | R15.2 8.59,43.26 Q1.3
N$9
  Top 0.254: R19.2 40.81,5.49 39.83,5.49 39.42,5.08 39.42,2.44 39.86,2 R23.1
  Top 0.406: Q4.1 42.89,2 R23.1
N$10
  Top 0.406: D3.A Q4.3 44.01,4.27 43.99,4.27 43.38,4.27 | R23.2 41.72,4.27 43.38,4.27 | CN4.3 45.31,4.27 44.4,4.27 43.38,4.27
N$11
  Top 0.254: 5.08,1.88 Q2.1 5.08,1.88 | 5.08,1.88 5.08,1.02 5.28,0.81 8.74,0.81 8.94,0.81 9.14,1.02 R16.1 10.33,2 10.57,2.23 | R14.2 9.18,5.49 10.16,5.49 10.57,5.08 | 10.57,5.08 10.57,2.23 | 10.57,5.08 10.57,2.23
N$12
  Top 0.254: C10.1 20.66,17.98 18.49,17.98 17.85,17.34 U5.20
N$13  (via drill 0.3)
  Top 0.254: U3.10 29.06,12.6 29.06,12.19 29.06,12.09 v29.46,11.68 | C9.1 22.21,11.92 22.76,11.38 | U5.10 17.35,11.71 17.35,10.7 17.48,10.57 17.68,10.36 18.49,10.36 19.2,10.36 19.51,10.36 19.71,10.57 20.12,10.97 22.35,10.97 22.76,11.38 | 22.76,11.38 v22.96,11.38 22.76,11.38
  Bottom 0.254: 29.46,11.58 v29.46,11.68 29.46,11.38 29.06,10.97 23.37,10.97 v22.96,11.38
N$14
  Top 0.254: D9.C 29.06,4.98 27.94,6.1 U2.8
N$15
  Top 0.406: 5.98,4.27 Q2.3 D2.A | 5.98,4.27 5.99,4.27 6.3,3.96 6.91,3.96 8.33,3.96 8.6,3.69 R16.2 | 5.98,4.27 5.67,3.96 4.37,3.96 CN3.3
N$16
  Top 0.305: Q5.1 42.89,41.11 R24.1 39.73,42.23 39.73,43.79 40.4,44.46 R20.2
N$17
  Top 0.406: D4.A Q5.3 | Q5.3 47.94,43.26 CN5.3 | R24.2 41.3,43.26 Q5.3
N$18
  Top 0.254: U1.28 24.91,23.65 24.91,23.45 25.81,22.55 29.06,22.55 29.67,21.95 R25.1
N$19
  Top 0.254: R27.1 27.53,2.88 D9.A
N$21
  Top 0.254: D8.A 24.21,1.36 R26.1
N$22
  Top 0.254: D8.C 21.74,5.05 U2.5
N$23
  Top 0.254: U2.2 20.02,6.6 19.54,6.13 R17.1
N$24
  Top 0.254: U2.4 20.73,5.59 20.52,5.38 20.32,5.18 20.12,4.98 20.12,1.79 R18.1
N$25
  Top 0.254: R21.1 35.39,39.01 30.48,39.01 30.28,39.01 29.06,37.8 26.62,37.8 26.42,37.8 26.21,37.8 25.91,37.5 U1.51
N$26
  Top 0.254: R22.1 32.96,39.62 29.87,39.62 28.65,38.41 26.01,38.41 25.41,37.81 U1.52
N$27
  Top 0.254: R21.2 37.8,43.12 D6.A
N$28
  Top 0.254: D7.A 33.93,45.05 R22.2
N$29  (via drill 0.3)
  Top 0.254: U1.20 20.93,25.17 20.93,24.18 20.52,23.77 v19.91,23.77 | v34.14,14.43 34.54,14.83 v37.19,14.83 | v41.86,14.43 42.06,14.22 R1.1
  Bottom 0.254: v19.91,23.77 18.9,23.77 18.09,24.59 15.24,24.59 15.04,24.59 12.8,22.35 12.8,20.52 13.82,19.51 30.28,19.51 30.68,19.51 34.14,16.05 v34.14,14.43 | v37.19,14.83 39.62,14.83 41.45,14.83 v41.86,14.43
NRST  (via drill 0.3)
  Top 0.254: R31.1 C7.2 14.43,31.29 14.77,31.64 U1.7 18.63,31.64 v18.9,31.9 | v30.07,30.89 v31.5,30.89 | v43.69,29.46 45.67,27.48 CN7.9
  Bottom 0.254: v18.9,31.9 25.2,31.9 26.21,30.89 v30.07,30.89 | v31.5,30.89 31.9,30.28 42.67,30.28 43.48,29.46 v43.69,29.46
SCL_SCLK
  Top 0.254: U5.23 16.31,18.3 R7.1 R8.1 21.5,18.69 26.21,18.69 27.23,18.69 28.25,17.67 U3.23
SDA_SDI  (via drill 0.3)
  Top 0.254: 15.8,17.48 15.8,18.5 R10.1 R9.1 | 15.8,17.48 U5.24 | U3.24 27.84,16.2 27.84,16.66 27.43,17.07 26.62,17.88 v25.81,17.88 | v15.04,18.09 15.19,18.09 15.8,17.48
  Bottom 0.254: v25.81,17.88 15.24,17.88 v15.04,18.09
SPI1_MISO
  Top 0.254: R11.2 21.91,23.44 U1.22
SPI1_MOSI  (via drill 0.3)
  Top 0.254: R10.2 15.61,22.76 v20.32,22.76 | U1.23 22.41,24.32 22.41,24.22 v22.66,23.98
  Bottom 0.254: v20.32,22.76 21.54,22.76 22.66,23.88 v22.66,23.98
SPI1_SCK
  Top 0.254: R8.2 21.41,22.67 U1.21
SPI2_CS  (via drill 0.3)
  Top 0.254: U1.33 28.96,27.05 v28.96,24.49
  Bottom 0.254: CN7.20 48.11,14.38 46.74,13.01 44.6,13.01 41.96,15.65 34.34,23.27 33.93,23.27 31.8,23.27 29.57,23.27 29.06,23.77 28.96,23.88 v28.96,24.49
SPI2_MISO  (via drill 0.3)
  Top 0.254: v42.88,23.37 v42.88,28.55 | U1.35 v31.59,28.14 v31.6,28.14
  Bottom 0.254: CN7.14 46.94,23.27 44.4,23.27 42.98,23.27 v42.88,23.37 | v31.6,28.14 32.61,28.14 32.72,28.25 32.92,28.45 42.77,28.45 v42.88,28.55
SPI2_MOSI  (via drill 0.3)
  Top 0.254: U1.36 31.07,28.64 31.39,28.96 32,28.96 32.11,28.85 33.53,27.43 33.53,26.42 v33.73,26.21
  Bottom 0.254: CN7.16 46.94,20.73 42.77,20.73 41.15,20.73 35.97,25.91 34.34,25.91 34.04,25.91 v33.73,26.21
SPI2_SCK  (via drill 0.3)
  Top 0.254: U1.34 29.77,27.64 29.97,27.64 30.07,27.53 v30.07,24.49
  Bottom 0.254: CN7.18 46.94,15.65 43.08,15.65 41.86,16.87 34.65,24.08 32.51,24.08 30.38,24.08 30.07,24.38 v30.07,24.49
SWCLK  (via drill 0.3)
  Top 0.254: 27.18,44.76 27.43,44.5 | 27.43,44.5 28.04,43.89 29.97,41.96 v31.5,40.44 | v28.04,36.58 26.93,36.58 U1.49 | CN6.2 27.13,44.81 27.43,44.5
  Bottom 0.254: v31.5,40.44 31.5,40.03 v28.04,36.58
SWDIO  (via drill 0.3)
  Top 0.254: v32.31,41.25 32.31,43.28 29.72,45.87 29.67,45.92 CN6.3 | U1.46 30.28,33.64 30.89,34.25 v30.89,35.15
  Bottom 0.254: v32.31,41.25 32.31,36.58 v30.89,35.15
TIM2_CH2  (via drill 0.3)
  Top 0.254: v13.82,13.01 14.02,13.21 14.02,16.26 14.02,17.88 v13.41,18.49 | v35.56,13.61 v37.8,13.61 | v44.91,11.79 45.67,12.55 CN7.19 | U1.15 16.66,27.64 16.15,27.13 16.05,27.03 v16.05,26.21
  Bottom 0.254: v16.05,26.21 15.65,26.21 13.01,23.57 11.99,22.55 11.99,19.51 12.8,18.69 13.01,18.49 v13.41,18.49 | v13.82,13.01 13.82,9.14 14.22,8.74 26.21,8.74 26.42,8.94 31.5,8.94 34.34,11.79 34.34,12.39 v35.56,13.61 | v37.8,13.61 43.08,13.61 v44.91,11.79
TIM3_CH1  (via drill 0.3)
  Top 0.254: U1.37 28.84,29.16 27.64,29.16 26.92,29.16 v24.99,31.09 | v9.25,30.07 7.32,32 v7.32,33.53 | R13.1 9.28,46.13 10.06,46.13 11.18,45.01 v11.18,44.5
  Bottom 0.254: v24.99,31.09 24.89,31.09 13.92,31.09 10.67,31.09 10.57,31.09 10.36,31.09 10.26,31.09 v9.25,30.07 | v7.32,33.53 9.14,35.36 9.14,42.47 v11.18,44.5
TIM3_CH2  (via drill 0.3)
  Top 0.254: R14.1 v9.14,8.53 | v27.03,30.18 27.56,29.64 U1.38
  Bottom 0.254: v27.03,30.18 24.69,30.18 24.38,30.48 17.07,30.48 14.43,30.48 13.61,30.48 8.74,25.6 8.74,24.79 8.74,21.95 8.13,21.34 8.13,18.69 8.74,18.09 9.14,17.68 9.14,17.48 9.14,16.87 v9.14,8.53
TIM3_CH3  (via drill 0.3)
  Top 0.254: R19.1 39.01,8.98 39.01,11.38 39.01,13.82 39.01,14.02 38.2,14.83 38.2,15.44 38.2,18.9 38.2,20.12 v39.42,21.34 | v33.73,24.99 34.44,25.7 34.44,27.33 32.61,29.16 31.64,30.14 U1.39
  Bottom 0.254: v33.73,24.99 36.07,24.99 39.22,21.84 39.42,21.64 v39.42,21.34
TIM3_CH4  (via drill 0.3)
  Top 0.254: v27.03,31.7 27.03,31.19 27.53,30.68 27.56,30.66 27.58,30.63 U1.40 | v35.76,37.59 36.98,37.59 39.01,39.62 39.01,40.23 39.01,44.13 R20.1
  Bottom 0.254: v27.03,31.7 28.25,32.92 29.67,34.34 31.39,34.34 33.63,36.58 34.65,37.59 v35.76,37.59
TS  (via drill 0.3)
  Top 0.254: U2.9 28.35,6.6 29.67,5.28 29.67,4.57 v29.87,4.37 | R1.2 40.64,9.92 v40.64,9.55 | v39.01,7.92 38.81,7.72 38.81,4.88 38.81,4.82 37.01,3.02 | v35.76,6.1 35.76,4.47 35.76,4.27 37.01,3.02 | 37.01,3.02 37.01,1.86 CN8.3
  Bottom 0.254: v40.64,9.55 39.22,8.13 v39.01,7.92 | v29.87,4.37 31.52,6.02 arc-45 31.7,6.1 v35.76,6.1
USART1_RX  (via drill 0.3)
  Top 0.254: 28.9,32.11 U1.43 31.02,32.14 v31.6,32.72
  Bottom 0.254: CN7.7 47.04,30.99 47.04,32.92 46.53,33.43 41.86,33.43 36.78,33.43 32.82,33.43 32.11,32.72 v31.6,32.72
USART1_TX  (via drill 0.3)
  Top 0.254: v31.8,31.8 31.64,31.64 U1.42
  Bottom 0.254: 45.62,32.11 CN7.5 44.91,32.92 33.12,32.92 32,31.8 v31.8,31.8
USART2_RX  (via drill 0.3)
  Top 0.254: U1.17 v18.49,25.2
  Bottom 0.254: CN7.10 46.94,25.81 45.92,25.81 44.5,25.81 43.38,26.92 | 43.38,26.92 43.08,27.23 | v18.49,25.2 20.83,25.2 31.29,25.2 32.82,26.72 33.33,27.23 33.43,27.33 35.46,27.33 42.16,27.33 42.98,27.33 43.38,26.92
USART2_TX  (via drill 0.3)
  Top 0.254: U1.16 17.47,27.13 18.69,27.13 v18.9,27.13
  Bottom 0.254: CN7.8 48.21,29.52 47.04,28.35 44.91,28.35 44.4,27.84 33.12,27.84 32.92,27.64 31.29,26.01 31.09,25.81 30.48,25.81 21.54,25.81 20.22,27.13 v18.9,27.13
USBDM  (via drill 0.3)
  Top 0.254: U1.44 27.51,32.64 26.29,32.64 v26.21,32.72 | v8.33,16.87 9.38,15.81 R2.2
  Bottom 0.254: 8.13,17.07 v8.33,16.87 7.52,17.68 7.52,21.95 8.13,22.55 8.13,26.42 8.13,30.18 11.48,33.53 18.09,33.53 23.37,33.53 24.59,33.53 24.99,33.53 25.4,33.53 v26.21,32.72
USBDP  (via drill 0.3)
  Top 0.254: R3.2 9.75,12.76 9.72,12.76 8.74,11.79 v7.11,11.79 7.11,10.94 R4.2 | 27.84,33.14 27.62,33.14 27.21,33.14 | 27.84,33.14 U1.45 | v26.21,33.73 26.81,33.14 27.84,33.14
  Bottom 0.254: v7.11,11.79 6.91,11.99 6.91,14.63 | 6.91,14.63 6.91,15.24 | 6.91,14.63 6.91,22.76 7.52,23.37 7.52,26.62 7.52,30.58 10.77,33.83 11.07,34.14 12.6,34.14 25.6,34.14 25.81,34.14 25.91,34.04 v26.21,33.73
V+
  Top 0.254: R26.2 25.02,2.88 R27.2 27.39,0.51 28.45,0.51 30.58,0.51 CN8.1
  Top 0.305: U2.10 25.5,7.75 25.5,8.33 | C6.1 22.35,9.72 22.35,8.33
  Top 0.406: U6.1 30.42,7.04 30.28,6.89 30.28,5.28 30.38,5.18 31.65,5.18 U6.3 31.62,2.41 31.62,2.11 CN8.1 | C11.1 31.62,9.71 U6.1 | U6.1 30.26,8.4 R29.1 28.61,8.4 28.55,8.33 28.25,8.33 27.43,8.33 25.5,8.33 22.35,8.33 20.52,8.33 18.29,8.33 17.48,8.33 17.07,7.92 D5.C | D2.C 4.27,7.74 4.27,5.38 3.05,4.17 CN3.2 | D3.C 45.72,7.74 45.72,5.89 47.45,4.17 CN4.2 | D1.C 3.13,45.82 CN2.2 | D4.C 46.76,45.82 CN5.2
  Bottom 0.813: 32,1.93 CN8.1 | CN8.1 27.23,1.83 22.15,1.83 19.81,4.17 CN3.2 3.15,4.17 5.49,6.5 5.49,10.26 2.34,13.41 2.34,20.32 2.34,34.44 2.34,35.97 5.08,38.71 5.08,42.67 4.57,43.18 CN2.2 CN5.2 | CN4.2 33.78,4.17 31.9,2.29 CN8.1
VBAT
  Top 0.305: BT1.+ 20.02,41.22 20.02,39.42 17.46,36.87 U1.1
VCC_IN  (via drill 0.3)
  Top 0.254: R37.1 R36.1 | U1.11 16.63,29.64 16.53,29.64 16.15,29.26 15.65,28.75 14.53,27.64 v13.21,27.64 | 7.11,19.3 R36.1 | v10.16,24.59 9.96,24.79 7.32,24.79 6.5,24.79 5.89,24.18 5.89,23.37 5.89,23.27 5.18,22.55 5.18,22.15 5.18,20.83 5.18,20.73 5.49,20.42 5.59,20.32 6.4,19.51 6.6,19.3 R36.1
  Bottom 0.254: v13.21,27.64 10.77,25.2 v10.16,24.59
WKUP  (via drill 0.3)
  Top 0.254: 18.38,28.14 U1.14 19.21,28.14 v19.3,28.04 | v35.76,12.39 36.78,12.39 v37.8,11.38 | v40.03,12.6 40.03,13.82 41.25,15.04 43.13,16.92 CN7.17 | v13.21,17.48 v13.21,14.43
  Bottom 0.254: v35.76,12.39 35.15,11.79 34.34,10.97 31.7,8.33 26.62,8.33 26.42,8.13 13.82,8.13 13.41,8.53 13.21,8.74 12.9,9.04 12.9,13.51 13.21,13.82 v13.21,14.43 | v37.8,11.38 38.81,11.38 v40.03,12.6 | v19.3,28.04 16.46,28.04 13.82,25.4 11.18,22.76 11.18,19.3 11.48,19 12.39,18.09 12.7,17.78 12.9,17.78 v13.21,17.48

### Text on the board
tPlace: Anambé Azul v1.4
tNames: GND | GND | +3V | SWCLK | SWDIO | GND | V+ | V+ | M1 | M4 | 1 | GND | GND | V+ | GND | +5V | V+ | GND | TS | V+ | M2 | M3